# EAGLE design Nusbio.TestExtension.01 (EAGLE 7.6.0)
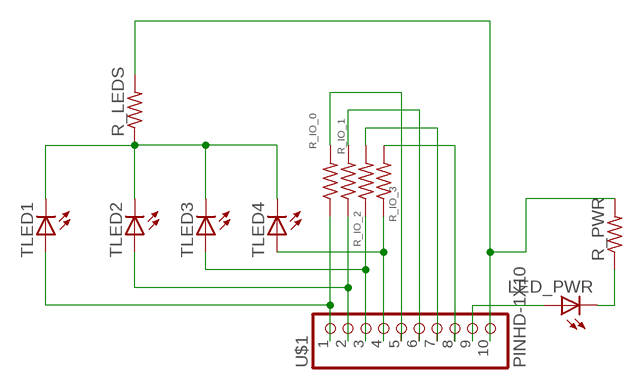
[diagram p0: schematic, sheet 1]

## Parts
LED_PWR  LEDSMT1206  [1206]
R_IO_0  R-US_R1206  [R1206]
R_IO_1  R-US_R1206  [R1206]
R_IO_2  R-US_R1206  [R1206]
R_IO_3  R-US_R1206  [R1206]
R_LEDS  R-US_R1206  [R1206]
R_PWR  R-US_R1206  [R1206]
TLED1  LEDSMT1206  [1206]
TLED2  LEDSMT1206  [1206]
TLED3  LEDSMT1206  [1206]
TLED4  LEDSMT1206  [1206]
U$1  PINHD-1X10  [1X10-BIG]

## Nets
N$1: R_IO_3.2 U$1.8
N$2: R_LEDS.1 TLED1.C TLED2.C TLED3.C TLED4.C
N$3: R_LEDS.2 R_PWR.2 U$1.10
N$4: LED_PWR.A U$1.9
N$5: LED_PWR.C R_PWR.1
N$6: R_IO_3.1 TLED4.A U$1.4
N$7: R_IO_0.1 TLED1.A U$1.1
N$8: R_IO_2.2 U$1.7
N$9: R_IO_1.2 U$1.6
N$10: R_IO_0.2 U$1.5
N$11: R_IO_2.1 TLED3.A U$1.3
N$12: R_IO_1.1 TLED2.A U$1.2

## Library data of the parts
LED_PWR TLED1-TLED4 = adafruit:LED: LED OSRAM: - CHIPLED LG R971, LG N971, LY N971, LG Q971, LY Q971, LO R971, LY R971 LH N974, LH R974 LS Q976, LO Q976, LY Q976 LO Q996 - Hyper CHIPLED LW Q18S LB Q993, LB Q99A, LB R99A - SideLED LS A670, LO A670, LY A670, LG A670, LP A670 LB A673, LV A673, LT A673, LW A673 LH A674 LY A675 LS A676, LA A676, LO A676, LY A676, LW A676 LS A679, LY A679, LG A679 - Hyper Micro SIDELED® LS Y876, LA Y876, LO Y876, LY Y876 LT Y87S - SmartLED LW L88C, LW L88S LB L89C, LB L89S, LG L890 LS L89K, LO L89K, LY L89K LS L896, LA L896, LO L896, LY L896 - TOPLED LS T670, LO T670, LY T670, LG T670, LP T670 LSG T670, LSP T670, LSY T670, LOP T670, LYG T670 LG T671, LOG T671, LSG T671 LB T673, LV T673, LT T673, LW T673 LH T674 LS T676, LA T676, LO T676, LY T676, LB T676, LH T676, LSB T676, LW T676 LB T67C, LV T67C, LT T67C, LS T67K, LO T67K, LY T67K, LW E67C LS E67B, LA E67B, LO E67B, LY E67B, LB E67C, LV E67C, LT E67C LW T67C LS T679, LY T679, LG T679 LS T770, LO T770, LY T770, LG T770, LP T770 LB T773, LV T773, LT T773, LW T773 LH T774 LS E675, LA E675, LY E675, LS T675 LS T776, LA T776, LO T776, LY T776, LB T776 LHGB T686 LT T68C, LB T68C - Hyper Mini TOPLED® LB M676 - Mini TOPLED Santana® LG M470 LS M47K, LO M47K, LY M47K Source: http://www.osram.convergy.de/
R_IO_0 R_IO_1-R_IO_3 R_LEDS R_PWR = adafruit:R-US_: RESISTOR, American symbol
U$1 = adafruit:PINHD-1X10: Pin header 1x10 0.1" spacing With round pins

## Board
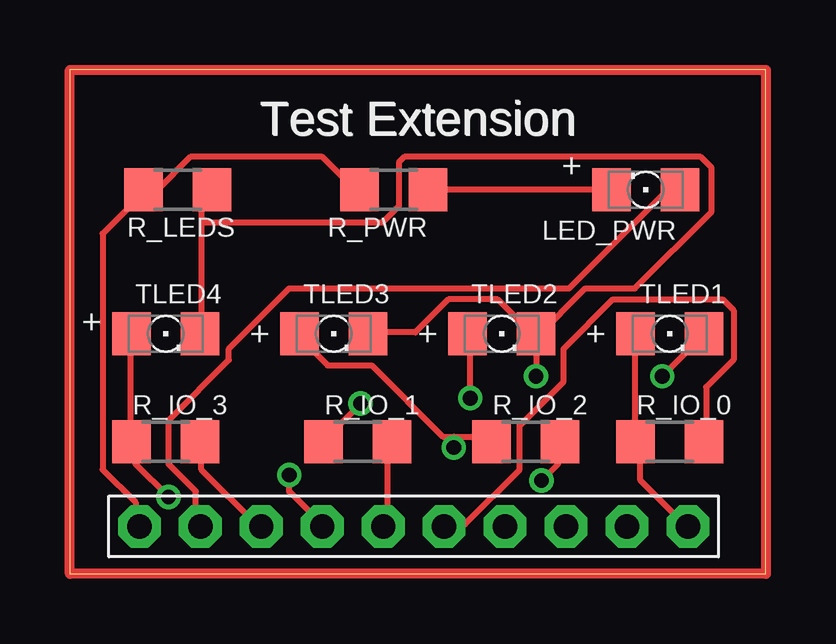
[diagram p1: board, top side]
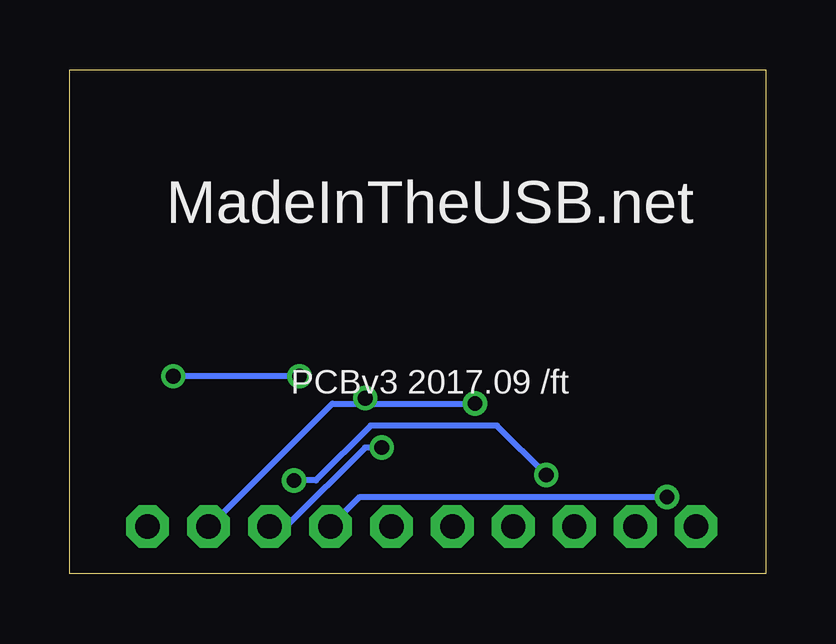
[diagram p2: board, bottom side, seen from below]

Size 29 x 21 mm. Coordinates in mm from the lower left corner, seen from the top.
Outline: 0,0 29,0 29,21 0,21 0,0
Copper layers (1*16): Top 0.035mm / dielectric 1.5mm / Bottom 0.035mm
Design rules "default": minimum track width 10mil, minimum drill 24mil, track to track 8mil, track to pad 8mil, pad to pad 8mil, via to via 8mil, smd to smd 8mil, copper to edge 40mil, drill to drill 8mil, minimum pad ring 10mil, minimum via ring 8mil, stop-mask expansion 4mil, vias tented up to drill 0mil, thermal gap 10mil

### Footprints (pad centres in the part's own frame; a part is rotated, then mirrored left to right if it is on the bottom)
1206 = smd 1.6 x 1.803: A -1.422,0; C 1.422,0
R1206 = smd 1.6 x 1.803: 1 -1.422,0; 2 1.422,0
1X10-BIG = drill 1.016 pad 1.778 octagon: 1 -11.43,0; 2 -8.89,0; 3 -6.35,0; 4 -3.81,0; 5 -1.27,0; 6 1.27,0; 7 3.81,0; 8 6.35,0; 9 8.89,0; 10 11.43,0

### Placement (x,y rotation side)
LED_PWR  24,16 180 top
R_IO_0  25,5.5 0 top
R_IO_1  12,5.5 0 top
R_IO_2  19,5.5 0 top
R_IO_3  4,5.5 0 top
R_LEDS  4.5,16 180 top
R_PWR  13.5,16 180 top
TLED1  25,10 0 top
TLED2  18,10 0 top
TLED3  11,10 0 top
TLED4  4,10 0 top
U$1  14.33,1.97 180 top

### Tracks (layer width: path | path; a pad name or v marks a point on that pad's centre or on a via)
N$1
  Top 0.254: R_IO_3.2 5.49,5.49 5.49,4.34 7.77,2.06 U$1.8
N$2  (via drill 0.61)
  Top 0.254: 5.49,14.63 5.49,15.54 5.71,15.77 R_LEDS.1 | 5.49,14.63 5.49,10.06 TLED4.C | TLED3.C 12.57,10.06 14.4,10.06 15.77,11.43 17.83,11.43 19.2,10.06 TLED2.C 19.43,9.83 | v24.69,8.23 26.29,9.83 TLED1.C | 19.43,9.83 v19.43,8.23 | 5.49,14.63 13.03,14.63 13.72,15.32 13.72,17.14 13.95,17.37 26.29,17.37 26.75,16.92 26.75,15.09 23.55,11.89 21.49,11.89 19.43,9.83
  Bottom 0.254: v19.43,8.23 v24.69,8.23
N$3
  Top 0.254: R_PWR.2 11.89,16 10.52,17.37 5.03,17.37 3.66,16 3.2,16 R_LEDS.2 2.97,15.77 1.37,14.17 1.37,4.34 2.74,2.97 2.74,2.06 U$1.10
N$4
  Top 0.254: LED_PWR.A 25.38,15.77 24.69,15.77 20.8,11.89 9.14,11.89 6.63,9.37 6.63,8.91 4.12,6.4 4.12,4.57 5.26,3.43 5.26,2.06 U$1.9
N$5
  Top 0.254: R_PWR.1 15.09,16 22.4,16 LED_PWR.C
N$6  (via drill 0.61)
  Top 0.254: TLED4.A 2.52,9.83 2.52,5.71 R_IO_3.1 2.74,5.49 2.74,4.57 v4.12,3.2
  Bottom 0.254: v4.12,3.2 16.92,3.2 18.06,2.06 U$1.4
N$7
  Top 0.254: TLED1.A 23.55,9.83 23.55,5.71 R_IO_0.1 23.77,5.49 23.77,3.89 25.6,2.06 U$1.1
N$8  (via drill 0.61)
  Top 0.254: v19.66,3.89 20.34,4.57 20.34,5.49 R_IO_2.2 | v9.14,4.12 9.14,3.43 10.52,2.06 U$1.7
  Bottom 0.254: v19.66,3.89 18.75,3.89 16.46,6.17 11.2,6.17 v9.14,4.12
N$9
  Top 0.254: R_IO_1.2 13.26,5.49 13.26,2.06 U$1.6
N$10
  Top 0.254: R_IO_0.2 26.52,5.71 26.52,7.77 27.66,8.91 27.66,10.97 27.2,11.43 22.63,11.43 20.57,9.37 20.57,8 18.75,6.17 18.75,4.34 16.46,2.06 15.77,2.06 U$1.5
N$11  (via drill 0.61)
  Top 0.254: 16,5.71 15.54,5.71 12.57,8.69 10.74,8.69 9.6,9.83 TLED3.A | 16,5.71 17.37,5.71 R_IO_2.1 | 16,5.71 v16,5.26
  Bottom 0.254: v16,5.26 16.69,5.26 19.89,2.06 20.57,2.06 U$1.3
N$12  (via drill 0.61)
  Top 0.254: v12.12,7.09 10.74,5.71 R_IO_1.1 | v16.69,7.32 16.69,9.83 TLED2.A
  Bottom 0.254: 16.69,7.09 18.06,7.09 23.09,2.06 U$1.2 | 16.69,7.09 v12.12,7.09 | 16.69,7.09 v16.69,7.32
N$13
  Top 0.406: 0,21 29,21 29,0 0,0 0,21

### Text on the board
tNames: Test Extension | Test Extension | + | + | + | + | +
bNames: MadeInTheUSB.net | PCBv3 2017.09 /ft